# EAGLE design md_adapter (EAGLE 7.6.0)
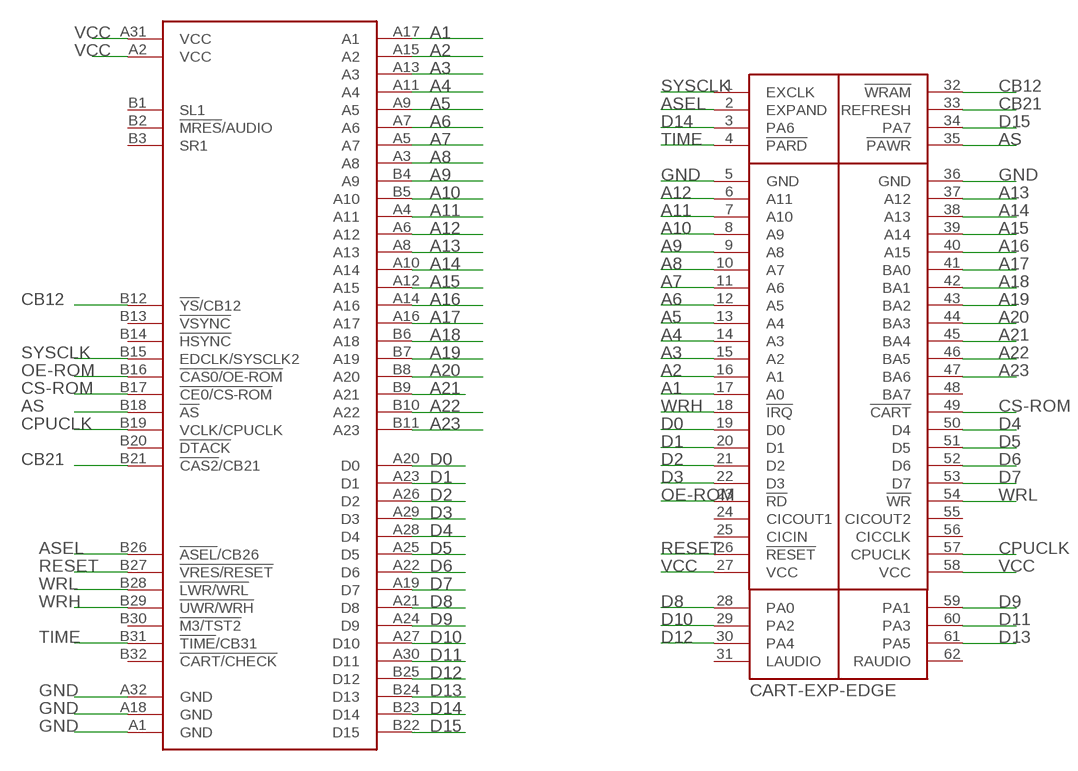
[diagram p0: schematic, sheet 1]

## Parts
CN3  MEGADRIVE-CART-CONNECTOR-ORDERED  [MEGADRIVE-CART-CONNECTOR]
U$1  CART-EXP-EDGE  [CART-EXP-PINS-LONG]

## Nets
A1: CN3.A17(A1) U$1.17(A0)
A2: CN3.A15(A2) U$1.16(A1)
A3: CN3.A13(A3) U$1.15(A2)
A4: CN3.A11(A4) U$1.14(A3)
A5: CN3.A9(A5) U$1.13(A4)
A6: CN3.A7(A6) U$1.12(A5)
A7: CN3.A5(A7) U$1.11(A6)
A8: CN3.A3(A8) U$1.10(A7)
A9: CN3.B4(A9) U$1.9(A8)
A10: CN3.B5(A10) U$1.8(A9)
A11: CN3.A4(A11) U$1.7(A10)
A12: CN3.A6(A12) U$1.6(A11)
A13: CN3.A8(A13) U$1.37(A12)
A14: CN3.A10(A14) U$1.38(A13)
A15: CN3.A12(A15) U$1.39(A14)
A16: CN3.A14(A16) U$1.40(A15)
A17: CN3.A16(A17) U$1.41(BA0)
A18: CN3.B6(A18) U$1.42(BA1)
A19: CN3.B7(A19) U$1.43(BA2)
A20: CN3.B8(A20) U$1.44(BA3)
A21: CN3.B9(A21) U$1.45(BA4)
A22: CN3.B10(A22) U$1.46(BA5)
A23: CN3.B11(A23) U$1.47(BA6)
AS: CN3.B18(!AS) U$1.35(!PAWR)
ASEL: CN3.B26(!ASEL!/CB26) U$1.2(EXPAND)
CB12: CN3.B12(!YS!/CB12) U$1.32(!WRAM)
CB21: CN3.B21(!CAS2!/CB21) U$1.33(REFRESH)
CPUCLK: CN3.B19(VCLK/CPUCLK) U$1.57(CPUCLK)
CS-ROM: CN3.B17(!CE0/CS-ROM) U$1.49(!CART)
D0: CN3.A20(D0) U$1.19(D0)
D1: CN3.A23(D1) U$1.20(D1)
D2: CN3.A26(D2) U$1.21(D2)
D3: CN3.A29(D3) U$1.22(D3)
D4: CN3.A28(D4) U$1.50(D4)
D5: CN3.A25(D5) U$1.51(D5)
D6: CN3.A22(D6) U$1.52(D6)
D7: CN3.A19(D7) U$1.53(D7)
D8: CN3.A21(D8) U$1.28(PA0)
D9: CN3.A24(D9) U$1.59(PA1)
D10: CN3.A27(D10) U$1.29(PA2)
D11: CN3.A30(D11) U$1.60(PA3)
D12: CN3.B25(D12) U$1.30(PA4)
D13: CN3.B24(D13) U$1.61(PA5)
D14: CN3.B23(D14) U$1.3(PA6)
D15: CN3.B22(D15) U$1.34(PA7)
GND [supply]: CN3.A1(GND) CN3.A18(GND) CN3.A32(GND) U$1.5(GND) U$1.36(GND)
OE-ROM: CN3.B16(!CAS0/OE-ROM) U$1.23(!RD)
RESET: CN3.B27(!VRES/RESET) U$1.26(!RESET)
SYSCLK: CN3.B15(EDCLK/SYSCLK2) U$1.1(EXCLK)
TIME: CN3.B31(!TIME!/CB31) U$1.4(!PARD)
VCC [supply]: CN3.A2(VCC) CN3.A31(VCC) U$1.27(VCC) U$1.58(VCC)
WRH: CN3.B29(!UWR/WRH) U$1.18(!IRQ)
WRL: CN3.B28(!LWR/WRL) U$1.54(!WR)
Unconnected: CN3.B1(SL1) CN3.B2(!MRES!/AUDIO) CN3.B3(SR1) CN3.B13(!VSYNC) CN3.B14(!HSYNC) CN3.B20(!DTACK) CN3.B30(!M3/TST2) CN3.B32(!CART/CHECK) U$1.24(CICOUT1) U$1.25(CICIN) U$1.31(LAUDIO) U$1.48(BA7) U$1.55(CICOUT2) U$1.56(CICCLK) U$1.62(RAUDIO)

## Library data of the parts
CN3 = arcadetv:MEGADRIVE-CART-CONNECTOR-ORDERED
U$1 = snes_cart_mod4:CART-EXP: 62-pin SNES cart edge with expansion connectors

## Net classes
0 default: width 0.203 mm, drill 0.203 mm, clearance 0.203 mm
1 supply: width 0.203 mm, drill 0.203 mm, clearance 0.203 mm

## Board
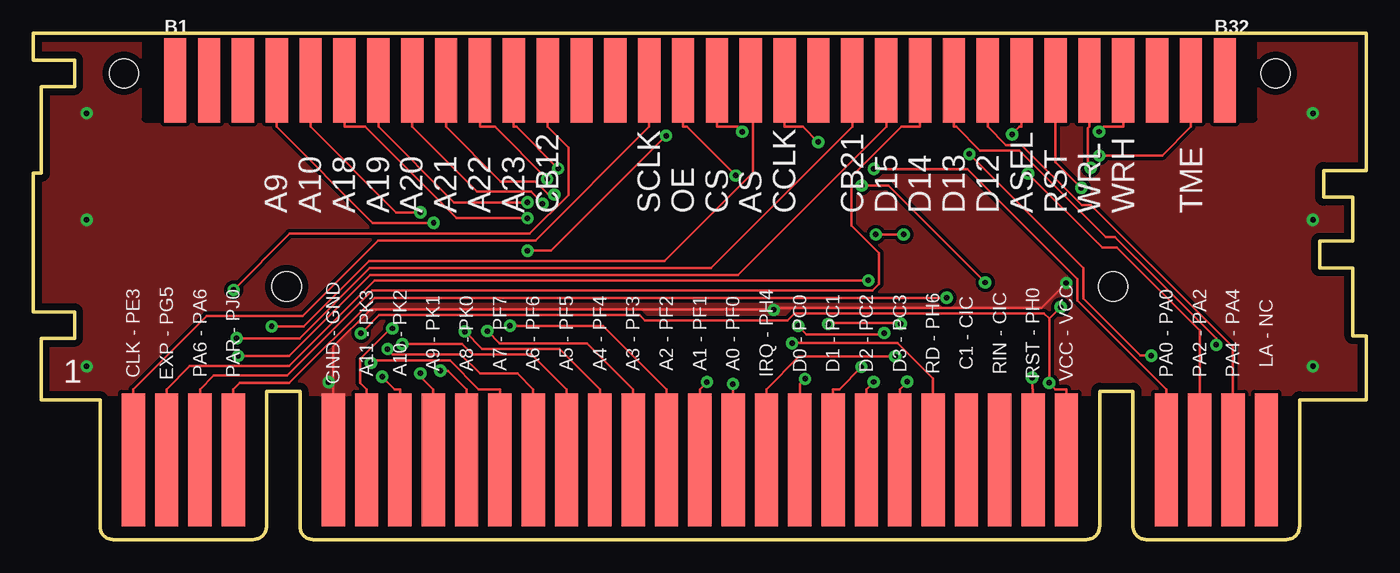
[diagram p1: board, top side]
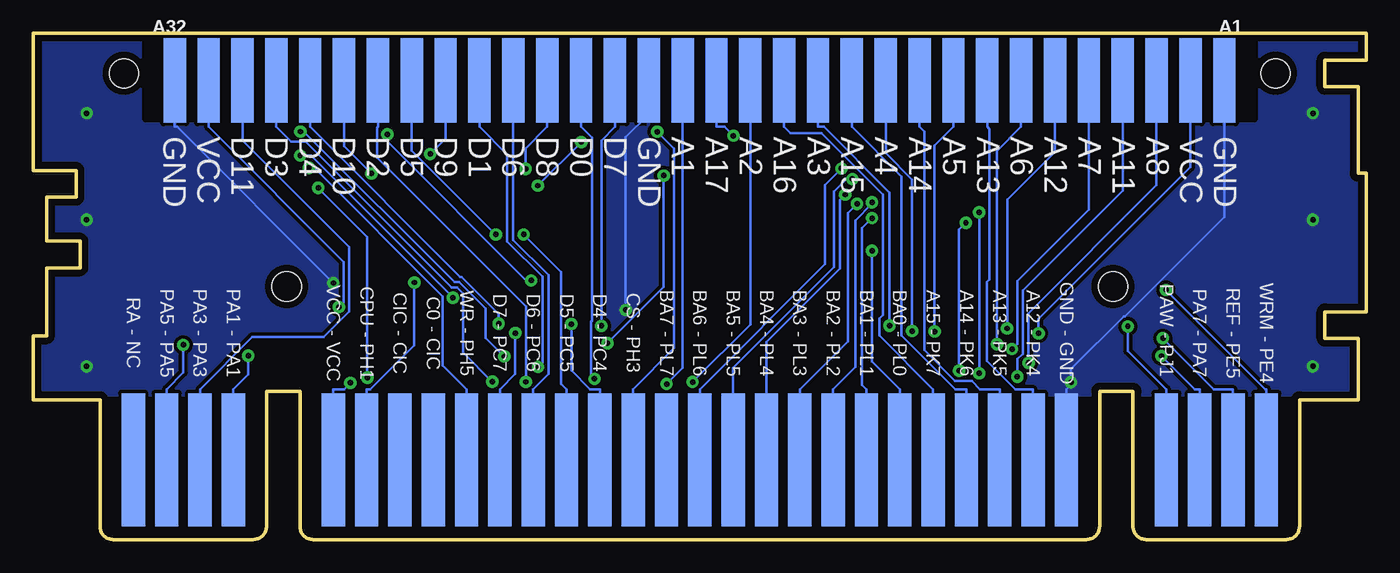
[diagram p2: board, bottom side, seen from below]

Size 100 x 38 mm. Coordinates in mm from the lower left corner, seen from the top.
Outline: 5,10.5 5,1 arc90 6,0 11.5,0 16.5,0 arc90 17.5,1 17.5,11.13 20,11.13 20,1 arc90 21,0 51,0 79,0 arc90 80,1 80,11.13 82.5,11.13 82.5,1 arc90 83.5,0 90,0 94,0 arc90 95,1 95,10.5 100,10.5 100,15.3 99,15.3 99,20.4 96.5,20.4 96.5,22.4 99,22.4 99,25.7 96.8,25.7 96.8,27.7 100,27.7 100,38 0,38 0,36 3.1,36 3.1,34 0.6,34 0.6,27.5 0,27.5 0,17.1 3.1,17.1 3.1,15.1 0.6,15.1 0.6,10.5 5,10.5
Copper layers (1*16): Top 0.035mm / dielectric 1.5mm / Bottom 0.035mm
Design rules "SparkFun_mod2": minimum track width 8mil, minimum drill 16mil, track to track 8mil, track to pad 8mil, pad to pad 8mil, via to via 8mil, smd to smd 8mil, copper to edge 20mil, drill to drill 12mil, minimum pad ring 12mil, minimum via ring 10mil, stop-mask expansion 4mil, vias tented up to drill 25mil, thermal gap 10mil
Holes 2.2 mm at 81,19 19,19 6.8,35 93.2,35
tRestrict: area -0.1,0.1 to 100,10.5; area 8.4,31.6 to 91.6,38
bRestrict: area -0.2,0 to 100,10.5; area 8.4,31.6 to 91.6,38

### Footprints (pad centres in the part's own frame; a part is rotated, then mirrored left to right if it is on the bottom)
MEGADRIVE-CART-CONNECTOR = smd 1.676 x 6.35 bottom: A1 0.838,3.175; A2 3.378,3.175; A3 5.918,3.175; A4 8.458,3.175; A5 10.998,3.175; A6 13.538,3.175; A7 16.078,3.175; A8 18.618,3.175; A9 21.158,3.175; A10 23.698,3.175; A11 26.238,3.175; A12 28.778,3.175; A13 31.318,3.175; A14 33.858,3.175; A15 36.398,3.175; A16 38.938,3.175; A17 41.478,3.175; A18 44.018,3.175; A19 46.558,3.175; A20 49.098,3.175; A21 51.638,3.175; A22 54.178,3.175; A23 56.718,3.175; A24 59.258,3.175; A25 61.798,3.175; A26 64.338,3.175; A27 66.878,3.175; A28 69.418,3.175; A29 71.958,3.175; A30 74.498,3.175; A31 77.038,3.175; A32 79.578,3.175 | smd 1.676 x 6.35: B1 0.838,3.175; B2 3.378,3.175; B3 5.918,3.175; B4 8.458,3.175; B5 10.998,3.175; B6 13.538,3.175; B7 16.078,3.175; B8 18.618,3.175; B9 21.158,3.175; B10 23.698,3.175; B11 26.238,3.175; B12 28.778,3.175; B13 31.318,3.175; B14 33.858,3.175; B15 36.398,3.175; B16 38.938,3.175; B17 41.478,3.175; B18 44.018,3.175; B19 46.558,3.175; B20 49.098,3.175; B21 51.638,3.175; B22 54.178,3.175; B23 56.718,3.175; B24 59.258,3.175; B25 61.798,3.175; B26 64.338,3.175; B27 66.878,3.175; B28 69.418,3.175; B29 71.958,3.175; B30 74.498,3.175; B31 77.038,3.175; B32 79.578,3.175
CART-EXP-PINS-LONG = smd 1.75 x 10 bottom: 1 42.5,-1.42; 2 40,-1.42; 3 37.5,-1.42; 4 35,-1.42; 5 27.5,-1.42; 6 25,-1.42; 7 22.5,-1.42; 8 20,-1.42; 9 17.5,-1.42; 10 15,-1.42; 11 12.5,-1.42; 12 10,-1.42; 13 7.5,-1.42; 14 5,-1.42; 15 2.5,-1.42; 16 0,-1.42; 17 -2.5,-1.42; 18 -5,-1.42; 19 -7.5,-1.42; 20 -10,-1.42; 21 -12.5,-1.42; 22 -15,-1.42; 23 -17.5,-1.42; 24 -20,-1.42; 25 -22.5,-1.42; 26 -25,-1.42; 27 -27.5,-1.42; 28 -35,-1.42; 29 -37.5,-1.42; 30 -40,-1.42; 31 -42.5,-1.42 | smd 1.75 x 10: 32 42.5,-1.42; 33 40,-1.42; 34 37.5,-1.42; 35 35,-1.42; 36 27.5,-1.42; 37 25,-1.42; 38 22.5,-1.42; 39 20,-1.42; 40 17.5,-1.42; 41 15,-1.42; 42 12.5,-1.42; 43 10,-1.42; 44 7.5,-1.42; 45 5,-1.42; 46 2.5,-1.42; 47 0,-1.42; 48 -2.5,-1.42; 49 -5,-1.42; 50 -7.5,-1.42; 51 -10,-1.42; 52 -12.5,-1.42; 53 -15,-1.42; 54 -17.5,-1.42; 55 -20,-1.42; 56 -22.5,-1.42; 57 -25,-1.42; 58 -27.5,-1.42; 59 -35,-1.42; 60 -37.5,-1.42; 61 -40,-1.42; 62 -42.5,-1.42

### Placement (x,y rotation side)
CN3  9.81,31.28 0 top
U$1  50,7.4 0 bottom

### Tracks (layer width: path | path; a pad name or v marks a point on that pad's centre or on a via)
A1  (via drill 0.41 pad 0.91)
  Top 0.203: U$1.17 52.5,11.29 52.48,11.3 v52.48,11.67
  Bottom 0.203: CN3.A17 51.29,30.98 51.29,12.87 v52.48,11.67
A2  (via drill 0.41 pad 0.91)
  Top 0.203: 50,11.29 | 50,11.29 v50.54,11.82 | U$1.16 50,11.29
  Bottom 0.203: v50.54,11.82 46.21,16.16 CN3.A15
A3  (via drill 0.41 pad 0.91)
  Top 0.203: v35.76,16.05 42.74,16.05 47.5,11.29 U$1.15
  Bottom 0.203: v35.76,16.05 35.76,26.05 40.69,30.98 41.13,30.98 CN3.A13
A4  (via drill 0.41 pad 0.91)
  Top 0.203: U$1.14 45,11.29 41.56,14.72 34.99,14.72 v34.06,15.64
  Bottom 0.203: CN3.A11 36.05,29.01 34.06,27.03 v34.06,15.64
A5  (via drill 0.41 pad 0.91)
  Top 0.203: v32.38,15.61 33.67,14.32 39.47,14.32 42.5,11.29 U$1.13
  Bottom 0.203: v32.38,15.61 32.38,29.57 30.97,30.98 CN3.A9
A6  (via drill 0.41 pad 0.91)
  Top 0.203: v27.69,14.67 32.19,14.67 32.94,13.91 37.37,13.91 40,11.29 U$1.12
  Bottom 0.203: v27.69,14.67 v27.7,14.67 27.7,29.16 25.89,30.98 CN3.A7
A7  (via drill 0.41 pad 0.91)
  Top 0.203: v26.57,14.3 26.97,13.9 32.07,13.9 33.52,12.45 36.33,12.45 37.5,11.29 U$1.11
  Bottom 0.203: v26.57,14.3 26.17,14.7 26.17,19.42 20.81,24.79 CN3.A5
A8  (via drill 0.41 pad 0.91)
  Top 0.203: v25.33,13.26 25.5,13.43 31.26,13.43 33.41,11.29 35,11.29 U$1.10
  Bottom 0.203: v25.33,13.26 25.36,13.29 25.36,16.96 15.73,26.59 CN3.A3
A9  (via drill 0.41 pad 0.91)
  Top 0.203: v30.54,12.67 31.11,12.67 32.5,11.29 U$1.9 | v30.03,23.77 25.47,23.77 18.27,30.98 CN3.B4
  Bottom 0.203: v30.03,23.77 30.54,23.26 v30.54,12.67
A10  (via drill 0.41 pad 0.91)
  Top 0.203: v29.04,24.56 27.22,24.56 20.81,30.98 CN3.B5 | v29.04,12.47 29.04,12.25 30,11.29 U$1.8
  Bottom 0.203: v29.04,12.47 v29.04,24.56
A11  (via drill 0.41 pad 0.91)
  Top 0.203: U$1.7 27.5,11.29 27.11,11.29 v26.17,12.22
  Bottom 0.203: v26.17,12.22 26.17,13.54 25.77,13.95 25.77,18.68 18.27,26.18 CN3.A4
A12  (via drill 0.41 pad 0.91)
  Top 0.203: v26.94,15.85 26.82,15.85 24.52,13.54 24.52,11.76 25,11.29 U$1.6
  Bottom 0.203: CN3.A6 23.35,29.09 26.94,25.5 v26.94,15.85
A13
  Bottom 0.203: CN3.A8 28.43,30.98 28.27,30.82 28.27,19.5 28.45,19.32 28.45,13.42 26.32,11.29 25,11.29 U$1.37
A14
  Bottom 0.203: CN3.A10 33.51,30.98 33.16,30.63 33.16,14.21 30.86,11.91 29.59,11.91 28.97,11.29 27.5,11.29 U$1.38
A15
  Bottom 0.203: CN3.A12 38.59,30.98 34.86,27.24 34.86,15.33 30.81,11.29 30,11.29 U$1.39
A16
  Bottom 0.203: CN3.A14 43.67,30.98 43.19,30.49 40.87,30.49 36.26,25.89 36.26,16.86 36.53,16.59 36.53,15.31 32.5,11.29 U$1.40
A17  (via drill 0.41 pad 0.91)
  Top 0.203: v37.07,21.68 38.84,21.68 v47.48,30.31
  Bottom 0.203: U$1.41 35,11.29 37.07,13.36 v37.07,21.68 | CN3.A16 48.75,30.98 48.14,30.98 v47.48,30.31
A18  (via drill 0.41 pad 0.91)
  Top 0.203: v37.08,24.13 31.75,24.13 24.91,30.98 23.35,30.98 CN3.B6
  Bottom 0.203: v37.08,24.13 37.84,23.37 37.84,11.62 37.5,11.29 U$1.42
A19  (via drill 0.41 pad 0.91)
  Top 0.203: v37.08,25.31 31.55,25.31 25.89,30.98 CN3.B7
  Bottom 0.203: v37.08,25.31 37.08,25.2 38.33,23.95 38.33,12.96 40,11.29 U$1.43
A20  (via drill 0.41 pad 0.91)
  Top 0.203: v38.2,25.2 38.2,25.27 37.34,26.12 33.28,26.12 28.43,30.98 CN3.B8
  Bottom 0.203: v38.2,25.2 38.9,24.5 38.9,14.89 42.5,11.29 U$1.44
A21  (via drill 0.41 pad 0.91)
  Top 0.203: v39.09,25.89 38.64,25.89 37.65,26.89 35.06,26.89 30.97,30.98 CN3.B9
  Bottom 0.203: U$1.45 45,14.81 39.49,20.33 39.49,25.49 v39.09,25.89
A22  (via drill 0.41 pad 0.91)
  Top 0.203: v38.55,27.06 34.64,30.98 33.51,30.98 CN3.B10
  Bottom 0.203: v38.55,27.06 39,27.06 39.95,26.11 39.95,20.44 47.5,12.89 47.5,11.29 U$1.46
A23  (via drill 0.41 pad 0.91)
  Top 0.203: v39.38,27.85 36.25,30.98 36.05,30.98 CN3.B11
  Bottom 0.203: v39.38,27.85 40.62,26.61 40.62,20.67 50,11.29 U$1.47
AS  (via drill 0.41 pad 0.91)
  Top 0.203: v17.88,16 20.27,16 25.19,20.92 47.37,20.92 54,27.55 54,34.28 CN3.B18
  Bottom 0.203: U$1.35 15,11.29 17.88,14.17 v17.88,16
ASEL  (via drill 0.41 pad 0.91)
  Top 0.203: v62.65,19.45 25.61,19.45 19.18,13.02 11.73,13.02 10,11.29 U$1.2 | CN3.B26 74.15,30.98 74,30.98 v73.44,30.41
  Bottom 0.203: v73.44,30.41 73.44,29.87 63.02,19.45 v62.65,19.45
CB12  (via drill 0.41 pad 0.91)
  Top 0.203: v15.02,18.73 19.25,22.96 37.23,22.96 40.15,25.87 40.15,29.42 38.59,30.98 CN3.B12
  Bottom 0.203: v15.02,18.73 7.57,11.29 7.5,11.29 U$1.32
CB21  (via drill 0.41 pad 0.91)
  Top 0.203: v15.25,15.11 19.96,15.11 25.22,20.37 50.84,20.37 61.45,30.98 CN3.B21
  Bottom 0.203: U$1.33 10,11.29 11.43,11.29 v15.25,15.11
CPUCLK  (via drill 0.41 pad 0.91)
  Top 0.203: v71.42,19.3 64.14,26.57 v62.15,26.57 | v58.89,29.84 57.75,30.98 56.37,30.98 CN3.B19
  Bottom 0.203: v71.42,19.3 71.42,14.59 74.72,11.29 75,11.29 U$1.57 | v62.15,26.57 v58.89,29.84
CS-ROM  (via drill 0.41 pad 0.91)
  Top 0.203: v53.19,30.61 52.83,30.98 51.29,30.98 CN3.B17
  Bottom 0.203: v53.19,30.61 51.92,29.34 51.92,14.37 55,11.29 U$1.49
D0  (via drill 0.41 pad 0.91)
  Top 0.203: v57.9,12.07 57.5,11.66 57.5,11.29 U$1.19
  Bottom 0.203: v57.9,12.07 58.15,12.31 58.15,16.36 58.09,16.42 58.09,30.15 58.91,30.98 CN3.A20
D1  (via drill 0.41 pad 0.91)
  Top 0.203: v62.13,12.95 60.46,11.29 60,11.29 U$1.20
  Bottom 0.203: v62.13,12.95 61.81,13.27 61.81,19.74 64.45,22.38 64.45,28.89 66.53,30.98 CN3.A23
D2  (via drill 0.41 pad 0.91)
  Top 0.203: v63.05,11.83 62.5,11.29 U$1.21
  Bottom 0.203: v63.05,11.83 63.05,17.5 74.21,28.66 74.21,30.91 74.15,30.98 CN3.A26
D3  (via drill 0.41 pad 0.91)
  Top 0.203: v65.56,11.85 65,11.29 U$1.22
  Bottom 0.203: v65.56,11.85 67.77,14.05 67.77,18.46 68.22,18.91 68.61,18.91 79.55,29.85 80.64,29.85 81.77,30.98 CN3.A29
D4  (via drill 0.41 pad 0.91)
  Top 0.203: v59.64,16.17 59.74,16.27 65.01,16.27 v65.08,16.19
  Bottom 0.203: v65.08,16.19 65.08,16.93 67.88,19.72 67.98,19.72 79.23,30.98 CN3.A28 | v59.64,16.17 59.64,12.69 58.23,11.29 57.5,11.29 U$1.50
D5  (via drill 0.41 pad 0.91)
  Top 0.203: v65.31,22.9 v63.21,22.9
  Bottom 0.203: v63.21,22.9 60.4,20.09 60.4,11.68 60,11.29 U$1.51 | v65.31,22.9 71.61,29.2 CN3.A25
D6
  Bottom 0.203: U$1.52 62.5,11.29 61.35,12.43 61.35,19.86 63.99,22.49 63.99,30.98 CN3.A22
D7  (via drill 0.41 pad 0.91)
  Top 0.203: v57.38,16.04 58.02,15.41 63.75,15.41 v63.84,15.5
  Bottom 0.203: U$1.53 65,11.29 63.84,12.45 v63.84,15.5 | CN3.A19 56.37,30.98 57.38,29.96 v57.38,16.04
D8  (via drill 0.41 pad 0.91)
  Top 0.203: v63.06,27.82 70.08,27.82 78.34,19.56 78.34,17.94 85,11.29 U$1.28
  Bottom 0.203: CN3.A21 61.45,30.98 63.06,29.36 v63.06,27.82
D9  (via drill 0.41 pad 0.91)
  Top 0.203: v83.87,13.8 83.06,13.8 78.78,18.08 78.78,20.38 v70.23,28.94
  Bottom 0.203: CN3.A24 69.07,30.1 v70.23,28.94 | U$1.59 85,11.29 83.87,12.41 v83.87,13.8
D10  (via drill 0.41 pad 0.91)
  Top 0.203: v74.63,27.48 80.2,21.91 81.3,21.91 87.5,15.71 87.5,11.29 U$1.29
  Bottom 0.203: v74.63,27.48 76.69,29.54 76.69,30.98 CN3.A27
D11
  Bottom 0.203: CN3.A30 84.31,29.94 76.31,21.95 76.31,17.13 78.23,15.22 83.57,15.22 87.5,11.29 U$1.60
D12
  Top 0.203: U$1.30 90,11.29 90,14.46 79.36,25.1 78.66,25.1 74.15,29.61 72.97,29.61 71.61,30.98 CN3.B25
D13  (via drill 0.41 pad 0.91)
  Top 0.203: v88.75,14.62 88.75,15.1 81.13,22.72 80.47,22.72 73.98,29.21 71.04,29.21 69.27,30.98 69.07,30.98 CN3.B24
  Bottom 0.203: v88.75,14.62 88.75,12.54 90,11.29 U$1.61
D14
  Top 0.203: CN3.B23 66.53,30.98 65.12,30.98 61.38,27.23 61.38,23.56 63.46,21.49 63.46,19.18 62.97,18.69 25.43,18.69 19.04,12.31 13.52,12.31 12.5,11.29 U$1.3
D15  (via drill 0.41 pad 0.91)
  Top 0.203: CN3.B22 63.99,30.98 52.87,19.86 25.29,19.86 19.21,13.78 v15.37,13.78
  Bottom 0.203: U$1.34 12.5,11.29 12.87,11.29 v15.37,13.78
GND  (via drill 0.41 pad 0.91)
  Top 0.203: v77.5,19.26 75.63,17.39 55.7,17.39 v55.55,17.24 55.52,17.27 25.29,17.27 22.5,14.48 22.5,11.81 | 22.5,11.81 22.5,11.29 U$1.36 | 22.5,11.81 v22.15,11.81
  Bottom 0.203: CN3.A18 53.83,31.91 55.55,30.19 v55.55,17.24 | CN3.A32 89.39,30.98 89.22,30.98 v77.5,19.26 | CN3.A1 10.65,24.21 18.1,16.76 18.2,16.76 22.15,12.81 v22.15,11.81 22.15,11.64 22.5,11.29 U$1.36
  other vias: 4,13 4,24 4,32 96,32 96,24 96,13
  pour Bottom (isolate 0.254): 0,38.02 99.95,38.02 99.95,0.08 0,0.08
  pour Top (isolate 0.254): 0,38.02 99.95,38.02 99.95,0.08 0,0.08
OE-ROM  (via drill 0.41 pad 0.91)
  Top 0.203: v56.93,14.74 64.84,14.74 67.5,12.08 67.5,11.29 U$1.23 | v52.7,27.33 49.06,30.98 48.75,30.98 CN3.B16
  Bottom 0.203: v52.7,27.33 52.7,18.96 v56.93,14.74
RESET  (via drill 0.41 pad 0.91)
  Top 0.203: U$1.26 75,11.29 74.94,11.35 v74.94,12.14 | v78.62,26.39 76.69,28.33 CN3.B27
  Bottom 0.203: v74.94,12.14 74.94,22.71 v78.62,26.39
SYSCLK
  Top 0.203: CN3.B15 46.21,30.98 37.67,22.44 25.86,22.44 20.2,16.78 13,16.78 7.5,11.29 U$1.1
TIME  (via drill 0.41 pad 0.91)
  Top 0.203: v68.53,18.15 25.6,18.15 19.2,11.75 15.46,11.75 15,11.29 U$1.4 | v79.98,28.82 84.7,28.82 86.85,30.98 CN3.B31
  Bottom 0.203: v68.53,18.15 68.53,18.19 79.16,28.82 v79.98,28.82
VCC  (via drill 0.41 pad 0.91)
  Top 0.203: 76.22,16.59 v77.08,17.45 | 76.22,16.59 v76.22,11.76 76.69,11.29 77.5,11.29 U$1.58 | 76.22,16.59 75.83,16.97 57.12,16.97 56.6,16.45 45.9,16.45 45.49,16.86 25.96,16.86 v24.58,15.48
  Bottom 0.203: CN3.A2 13.19,27.95 24.58,16.56 v24.58,15.48 | v24.58,15.48 | v77.08,17.45 76.72,17.8 76.72,20.85 86.85,30.98 CN3.A31 | U$1.58 77.5,11.29 76.69,11.29 v76.22,11.76
WRH  (via drill 0.41 pad 0.91)
  Top 0.203: v79.96,30.62 80.31,30.98 81.77,30.98 CN3.B29 | v64.67,13.74 57.46,13.74 55,11.29 U$1.18
  Bottom 0.203: v79.96,30.62 79.71,30.62 68.41,19.32 68.05,19.32 66.07,17.34 66.07,15.15 v64.67,13.74
WRL  (via drill 0.41 pad 0.91)
  Top 0.203: v79.32,27.9 79.14,28.09 79.14,30.88 79.23,30.98 CN3.B28
  Bottom 0.203: v79.32,27.9 78.95,27.9 69.29,18.25 69.29,13.08 67.5,11.29 U$1.54

### Text on the board
tNames: A9 / A10 / A18 / A19 / A20 / A21 / A22 / A23 / CB12 / / / SCLK / OE / CS / AS / CCLK / / CB21 / D15 / D14 / D13 / D12 / ASEL / RST / WRL / WRH / / TME | CLK - PE3 / EXP - PG5 / PA6 - PA6 / PAR - PJ0 / / / GND - GND / A11 - PK3 / A10 - PK2 / A9 - PK1 / A8 - PK0 / A7 - PF7 / A6 - PF6 / A5 - PF5 / A4 - PF4 / A3 - PF3 / A2 - PF2 / A1 - PF1 / A0 - PF0 / IRQ - PH4 / D0 - PC0 / D1 - PC1 / D2 - PC2 / D3 - PC3 / RD - PH6 / C1 - CIC / RIN - CIC / RST - PH0 / VCC - VCC / / / PA0 - PA0 / PA2 - PA2 / PA4 - PA4 / LA - NC | 1
bNames: GND / VCC / A8 / A11 / A7 / A12 / A6 / A13 / A5 / A14 / A4 / A15 / A3 / A16 / A2 / A17 / A1 / GND / D7 / D0 / D8 / D6 / D1 / D9 / D5 / D2 / D10 / D4 / D3 / D11 / VCC / GND | WRM - PE4 / REF - PE5 / PA7 - PA7 / PAW - PJ1 / / / GND - GND / A12 - PK4 / A13 - PK5 / A14 - PK6 / A15 - PK7 / BA0 - PL0 / BA1 - PL1 / BA2 - PL2 / BA3 - PL3 / BA4 - PL4 / BA5 - PL5 / BA6 - PL6 / BA7 - PL7 / CS - PH3 / D4 - PC4 / D5 - PC5 / D6 - PC6 / D7 - PC7 / WR - PH5 / C0 - CIC / CIC - CIC / CPU - PH1 / VCC - VCC / / / PA1 - PA1 / PA3 - PA3 / PA5 - PA5 / RA - NC